# Altium schematic sheet LCD.SchDoc: LCD I2C BLOCK
size A4; SheetNumber: 3; SheetTotal: 7; DOC_NO_SCH_DWG: #022024031502
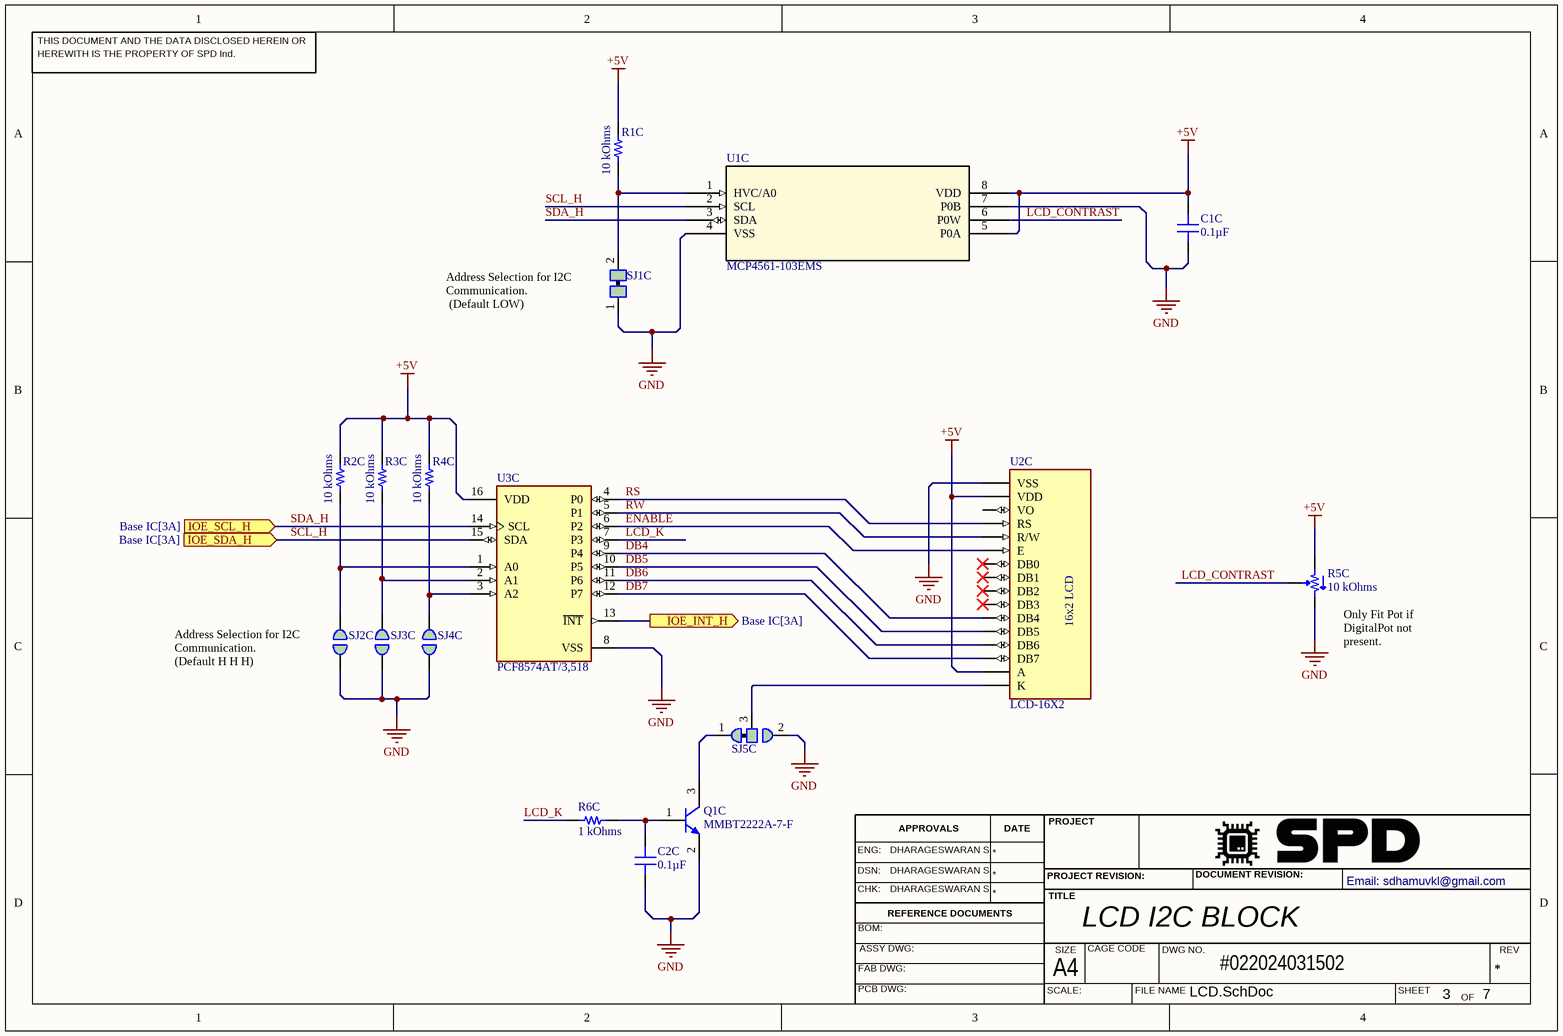
[diagram p0: LCD.SchDoc]

## Parts
C1C  0.1µF  [CAP 0402_1005]
C2C  0.1µF  [CAP 0402_1005]
Q1C  MMBT2222A-7-F  [DIODES SOT-23-3]
R1C  10 kOhms  [RES 0402_1005]
R2C  10 kOhms  [RES 0402_1005]
R3C  10 kOhms  [RES 0402_1005]
R4C  10 kOhms  [RES 0402_1005]
R5C  10 kOhms  [BOURNS TRIMPOT 3299P]
R6C  1 kOhms  [RES 0402_1005]
SJ1C  2PIN  [Rectangular Jumper Joint]  (value not drawn)
SJ2C  2PIN  [Rounded Jumper]  (value not drawn)
SJ3C  2PIN  [Rounded Jumper]  (value not drawn)
SJ4C  2PIN  [Rounded Jumper]  (value not drawn)
SJ5C  3PIN  [Rounded Jumper Joint 3-pin]  (value not drawn)
U1C  MCP4561-103EMS  [MSOP8_MC_MCH]
U2C  LCD-16X2  [LCD-16X2 Pin]
U3C  PCF8574AT/3,518  [FP-SOT162-1-MFG]

## Ports
IOE_INT_H (out, see Base IC[3A]), IOE_SCL_H (in, see Base IC[3A]), IOE_SDA_H (in, see Base IC[3A])

## Nets
+5V: C1C.2 R1C.2 R2C.2 R3C.2 R4C.2 R5C.1 U1C.5(P0A) U1C.8(VDD) U2C.2(VDD) U2C.15(A) U3C.16(VDD)
GND: C1C.1 C2C.1 Q1C.2(E) R5C.3 SJ1C.1 SJ2C.1 SJ3C.1 SJ4C.1 SJ5C.2 U1C.4(VSS) U1C.7(P0B) U2C.1(VSS) U3C.8(VSS)
DB4: U2C.11(DB4) U3C.9(P4)
DB5: U2C.12(DB5) U3C.10(P5)
DB6: U2C.13(DB6) U3C.11(P6)
DB7: U2C.14(DB7) U3C.12(P7)
ENABLE: U2C.6(E) U3C.6(P2)
IOE_INT_H: U3C.13(~{INT}) ; port IOE_INT_H
LCD_CONTRAST: R5C.2 U1C.6(P0W)
LCD_K: R6C.1 U3C.7(P3)
RS: U2C.4(RS) U3C.4(P0)
RW: U2C.5(R/W) U3C.5(P1)
SCL_H: U1C.2(SCL) U3C.15(SDA) ; port IOE_SDA_H
SDA_H: U1C.3(SDA) U3C.14(SCL) ; port IOE_SCL_H
NetC2C_2: C2C.2 Q1C.1(B) R6C.2
NetQ1C_3: Q1C.3(C) SJ5C.1
NetR1C_1: R1C.1 SJ1C.2 U1C.1(HVC/A0)
NetR2C_1: R2C.1 SJ2C.2 U3C.1(A0)
NetR3C_1: R3C.1 SJ3C.2 U3C.2(A1)
NetR4C_1: R4C.1 SJ4C.2 U3C.3(A2)
NetSJ5C_3: SJ5C.3 U2C.16(K)

Not connected (* = marked no-connect by the designer): U2C 3(VO) 7(DB0)* 8(DB1)* 9(DB2)* 10(DB3)*

## Notes on the sheet
- (near SJ1C) Address Selection for I2C Communication.
  (Default LOW)
- (near SJ2C) Address Selection for I2C Communication.
  (Default H H H)
- (near R5C) Only Fit Pot if DigitalPot not present.
- THIS DOCUMENT AND THE DATA DISCLOSED HEREIN OR
- HEREWITH IS THE PROPERTY OF SPD Ind.
- ENG:
- DHARAGESWARAN S
- APPROVALS
- DATE
- PROJECT
- DSN:
- CHK:
- REFERENCE DOCUMENTS
- PROJECT REVISION:
- TITLE
- DOCUMENT REVISION:
- Email: sdhamuvkl@gmail.com <https://github.com/DhamuVkl>
- BOM:
- FAB DWG:
- PCB DWG:
- ASSY DWG:
- SCALE:
- A4
- SIZE
- CAGE CODE
- FILE NAME
- DWG NO.
- SHEET
- REV
- OF
- (in symbol LCD-16X2) 16x2 LCD

## Library data of the parts
C1C C2C = 0402YC104KAT2A: CAP CER 0.1UF 16V X7R 0402; Manufacturer: AVX Corporation; id: 643; Tolerance: ±10%; Part Number: 0402YC104KAT2A; Value: 0.1µF; Temperature Coefficient: X7R; Supplier Part Number 1: 478-7888-1-ND; ComponentLink2Description: DigiKey Link; ComponentLink1URL: http://datasheets.avx.com/X7RDielectric.pdf; PartId: 3104; Supplier 1: DigiKey; Series: -; LastUpdated: 2022-02-08T12:26:55.697; Part Status: Active; Capacitance: 0.1µF; Device Package: 0402 (1005 Metric); Thickness (Max): 0.022" (0.55mm); Voltage - Rated: 16V; Minimum Order: 1; Packaging: TapeAndReel; Applications: General Purpose; Package / Case: 0402 (1005 Metric); ComponentLink1Description: Datasheet; Price: 0.01; ComponentLink2URL: http://digikey.com/product-detail/en/avx-corporation/0402YC104KAT2A/478-7888-1-ND/3881511; Lifecycle Status: Active; Operating Temperature: -55°C ~ 125°C; Size / Dimension: 0.039" L x 0.020" W (1.00mm x 0.50mm); Mounting Type: Surface Mount, MLCC
Q1C = MMBT2222A-7-F: TRANS NPN 40V 0.6A SOT23-3; Manufacturer: Diodes Incorporated; id: 84; Current - Collector (Ic) (Max): 600 mA; Power - Max: 310 mW; DC Current Gain (Hfe) (Min) @ Ic, Vce: 100 @ 150mA, 10V; Current - Collector Cutoff (Max): 10nA (ICBO); Vce Saturation (Max) @ Ib, Ic: 1V @ 50mA, 500mA; Frequency - Transition: 300MHz; Part Number: MMBT2222A-7-F; Supplier Part Number 1: MMBT2222A-FDICT-ND; Supplier Device Package: SOT-23-3; ComponentLink1Description: Datasheet; ComponentLink2URL: https://www.digikey.com/en/products/detail/diodes-incorporated/MMBT2222A-7-F/814503; ComponentLink1URL: https://www.diodes.com/assets/Datasheets/ds30041.pdf; Supplier 1: DigiKey; Series: Automotive, AEC-Q101; Part Status: Active; ComponentLink2Description: DigiKey Link; Packaging: TapeAndReel; Minimum Order: 1; Transistor Type: NPN; Voltage - Collector Emitter Breakdown (Max): 40 V; Package / Case: TO-236-3, SC-59, SOT-23-3; PartId: 84; Lifecycle Status: Active; LastUpdated: 2023-01-02T21:11:05.533; Operating Temperature: -55°C ~ 150°C (TJ); Mounting Type: Surface Mount; Price: 0.02
R1C R2C R3C R4C = AC0402FR-1310KL: RES 10K OHM 1% 1/16W 0402; Manufacturer: Yageo; id: 13132; Temperature Coefficient: ±100ppm/°C; Power (Watts): 0.063W, 1/16W; Part Number: AC0402FR-1310KL; Height - Seated (Max): 0.015" (0.37mm); Supplier Part Number 1: 13-AC0402FR-1310KLCT-ND; Supplier Device Package: 0402; ComponentLink1Description: Datasheet; ComponentLink2URL: https://www.digikey.com/en/products/detail/yageo/AC0402FR-1310KL/12756397; Features: Automotive AEC-Q200, Moisture Resistant; ComponentLink1URL: https://www.yageo.com/upload/media/product/productsearch/datasheet/rchip/PYu-AC_51_RoHS_L_8.pdf; Composition: Thick Film; Tolerance: ±1%; Supplier 1: DigiKey; Series: AC; Part Status: Active; ComponentLink2Description: DigiKey Link; Device Package: 0402 (1005 Metric); Packaging: CutTape; Ratings: AEC-Q200; Minimum Order: 1; Package / Case: 0402 (1005 Metric); PartId: 69220; Lifecycle Status: Active; LastUpdated: 2023-01-02T20:19:54.633; Operating Temperature: -55°C ~ 155°C; Number Of Terminations: 2; Value: 10 kOhms; Size / Dimension: 0.039" L x 0.020" W (1.00mm x 0.50mm); Price: 0.01; Resistance: 10 kOhms
R5C = 3299P-1-103LF: TRIMMER 10K OHM 0.5W PC PIN SIDE; Manufacturer: Bourns Inc.; id: 276; Temperature Coefficient: ±100ppm/°C; Resistive Material: Cermet; Tolerance: ±10%; Number Of Turns: 25; Adjustment Type: Side Adjustment; Power (Watts): 0.5W, 1/2W; Part Number: 3299P-1-103LF; Supplier Part Number 1: 3299P-103LF-ND; ComponentLink1Description: Datasheet; ComponentLink2URL: https://www.digikey.com/en/products/detail/bourns-inc/3299P-1-103LF/1088121; ComponentLink1URL: https://www.bourns.com/docs/Product-Datasheets/3299.pdf; Supplier 1: DigiKey; Series: Trimpot® 3299 - Sealed; Part Status: Active; ComponentLink2Description: DigiKey Link; Packaging: Tube; Minimum Order: 1; PartId: 276; Lifecycle Status: Active; LastUpdated: 2023-01-02T21:13:50.730; Termination Style: PC Pins; Value: 10 kOhms; Size / Dimension: Rectangular - 0.240" x 0.375" Face (6.10mm x 9.53mm); Mounting Type: Through Hole; Price: 1.61; Resistance: 10 kOhms
R6C = AC0402DR-071KL: RES 1K OHM 0.5% 1/16W 0402; Manufacturer: Yageo; id: 14909; Temperature Coefficient: ±100ppm/°C; Power (Watts): 0.063W, 1/16W; Part Number: AC0402DR-071KL; Height - Seated (Max): 0.015" (0.37mm); Supplier Part Number 1: 13-AC0402DR-071KLCT-ND; Supplier Device Package: 0402; ComponentLink1Description: Datasheet; ComponentLink2URL: https://www.digikey.com/en/products/detail/yageo/AC0402DR-071KL/16990461; Features: Automotive AEC-Q200, Moisture Resistant; ComponentLink1URL: https://www.yageo.com/upload/media/product/productsearch/datasheet/rchip/PYu-AC_51_RoHS_L_9.pdf; Composition: Thick Film; Tolerance: ±0.5%; Supplier 1: DigiKey; Series: AC; ComponentLink2Description: DigiKey Link; Device Package: 0402 (1005 Metric); Packaging: TapeAndReel; Ratings: AEC-Q200; Minimum Order: 1; Package / Case: 0402 (1005 Metric); PartId: 81039; Lifecycle Status: Active; LastUpdated: 2023-09-02T19:18:23.727; Operating Temperature: -55°C ~ 155°C; Number Of Terminations: 2; Value: 1 kOhms; Size / Dimension: 0.039" L x 0.020" W (1.00mm x 0.50mm); Price: 0.01; Resistance: 1 kOhms
SJ1C = Regtangular Jumper Joint
SJ2C SJ3C SJ4C = Rounded Jumper
SJ5C = Rounded Jumper Joint 3-pin
U1C = MCP4561-103EMS: No Description Available; Mfr_Name: Microchip; RefDes: RefDes; Type: Type; Supplier 1: Mouser; Supplier Part Number 1: 579-MCP4561-103E/MS
U2C = LCD-16X2: Display Development Tools 16x2 Black on Green Char LCD w Backlight; MF: Gravitech; Package: None; Price: None; Value: *; SnapEDA_Link: https://www.snapeda.com/parts/LCD-16X2/Gravitech/view-part/?ref=snap; MP: LCD-16X2; Availability: Not in stock; Check_prices: https://www.snapeda.com/parts/LCD-16X2/Gravitech/view-part/?ref=eda
U3C = CMP-10112-000003-1: IC I/O EXPANDER I2C 8B 16SOIC; Manufacturer: NXP Semiconductors; Interface: I2C,SMBus; Frequency: 100kHz; Nominal Supply Current: 40uA; Max Supply Voltage: 6V; Number Of I/Os: 8; Max Junction Temp: +125°C; Min Supply Voltage: 2.5V; Standoff Height: 0.1mm; RoHS: TRUE; Category: IC; Temperature: -40°C to +85°C; Device Class L3: I/O Expanders; ComponentLink2Description: Datasheet; ComponentLink2URL: https://www.nxp.com/docs/en/data-sheet/PCF8574_PCF8574A.pdf; Digikey Description: IC I/O EXPANDER I2C 8B 16SOIC; Ipc Land Pattern Name: SOIC127P1032X265-16; Mouser Description: PCF8574 Series 2.5 to 6V Remote 8-bit I/O Expander for I2C-bus -SOIC-16; Footprint Url: https://www.nxp.com/docs/en/package-information/SOT162-1.pdf; Lead Free: Yes; Device Class L2: Interface ICs; Ambient Temperature Range Low: -40°C; Temperature Range High: +85°C; Automotive: No; Manufacturer Part Number: PCF8574AT/3,518; Ambient Temperature Range High: +85°C; Height: 2.65mm; Package: SOT162-1; Temperature Range Low: -40°C; Octopart: https://octopart.com/pcf8574at%2F3%2C518-nxp+semiconductors-11541925; Device Class L1: Integrated Circuits (ICs)